# Altium schematic sheet RTC_SCH.SchDoc
size A4
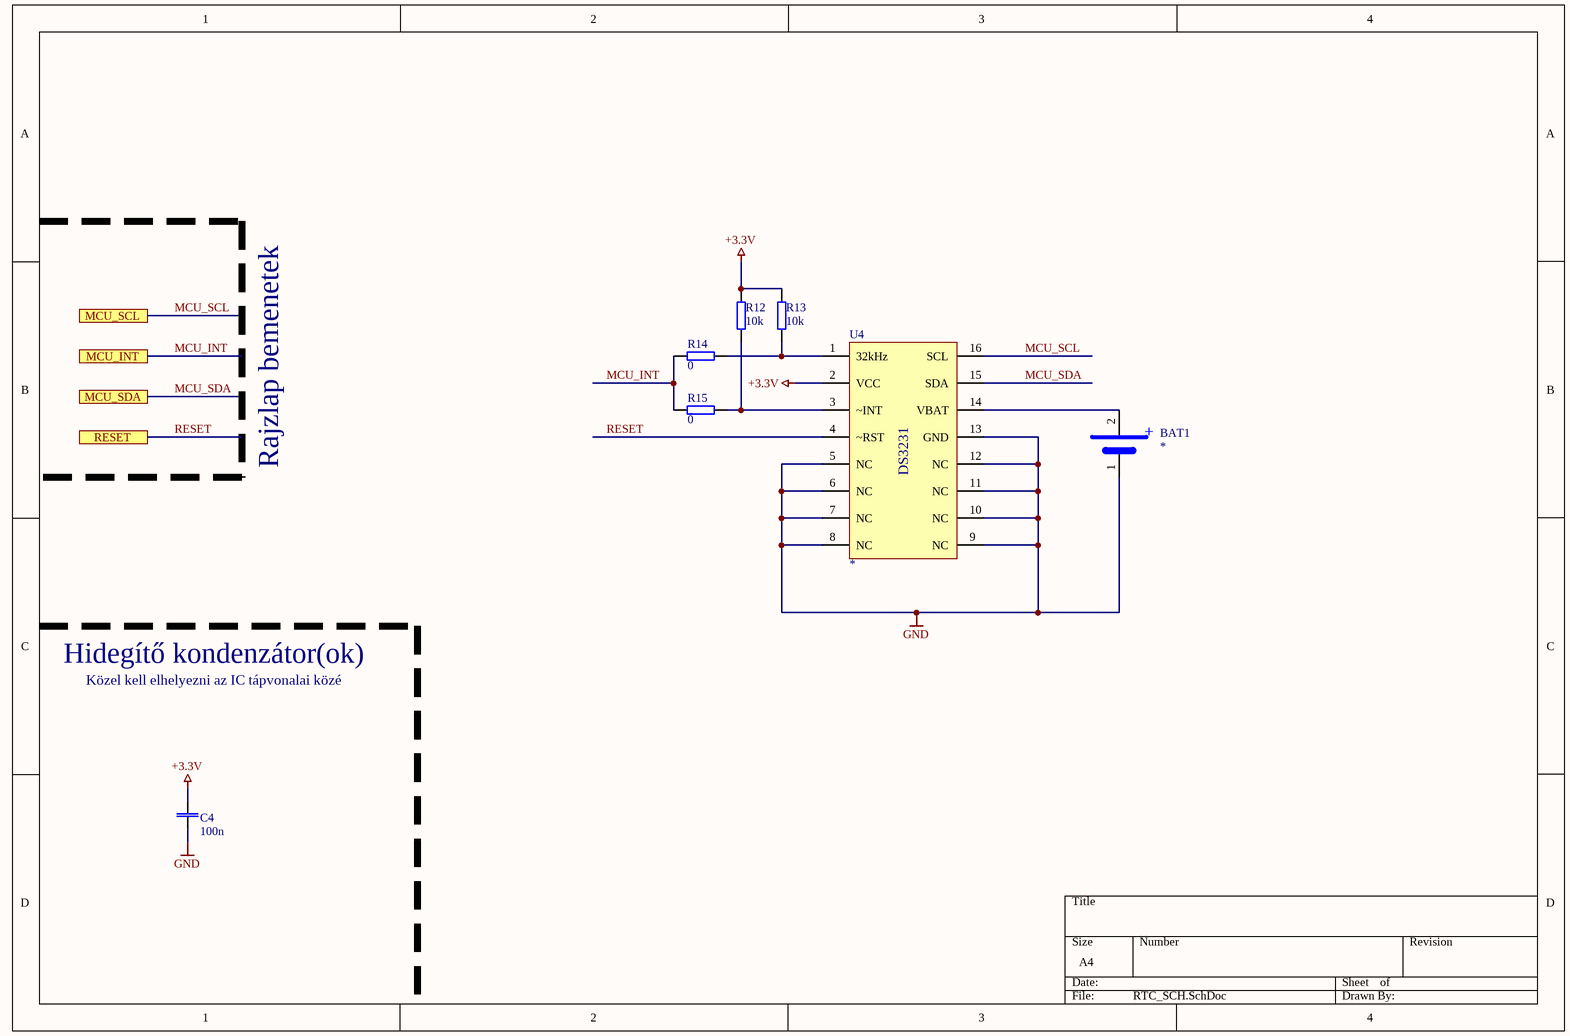
[diagram p0: RTC_SCH.SchDoc]

## Parts
BAT1  *  [CR2032]
C4  100n  [CAP 0805]
R12  10k  [RES 0805]
R13  10k  [RES 0805]
R14  0  [RES 0805]
R15  0  [RES 0805]
U4  *  [SO16W]

## Ports
MCU_INT, MCU_SCL, MCU_SDA, RESET

## Nets
+3.3V: C4.2 R12.2 R13.2 U4.2(VCC)
GND: BAT1.1 C4.1 U4.5(NC) U4.6(NC) U4.7(NC) U4.8(NC) U4.9(NC) U4.10(NC) U4.11(NC) U4.12(NC) U4.13(GND)
MCU_INT: R14.2 R15.2 ; port MCU_INT
MCU_SCL: U4.16(SCL) ; port MCU_SCL
MCU_SDA: U4.15(SDA) ; port MCU_SDA
RESET: U4.4(~RST) ; port RESET
NetBAT1_2: BAT1.2 U4.14(VBAT)
NetR12_1: R12.1 R15.1 U4.3(~INT)
NetR13_1: R13.1 R14.1 U4.1(32kHz)

## Notes on the sheet
- Rajzlap bemenetek
- Hidegítő kondenzátor(ok)
- Közel kell elhelyezni az IC tápvonalai közé
- (in symbol Battery) +

## Library data of the parts
BAT1 = Battery: VALUE: *; Supplier: *; Reference: *
C4 = CAP: NON POLARIZED CAPACITOR; VALUE: 100n; Reference: 82-10-76; Supplier: Lomex
R12-R15 = RES: RESISTOR; Supplier: Lomex
  R12 R13: Reference: 81-10-99; VALUE: 10k
  R14 R15: Reference: 81-10-02; VALUE: 0
U4 = DS3231: 3.3V Real Time Clock IC; Supplier: *; Reference: *; VALUE: *